# EAGLE schematic rotaryfona (EAGLE 7.7.0)
COMPANY: ADAFRUIT INDUSTRIES; DRAWN: KTOWN; REV: C
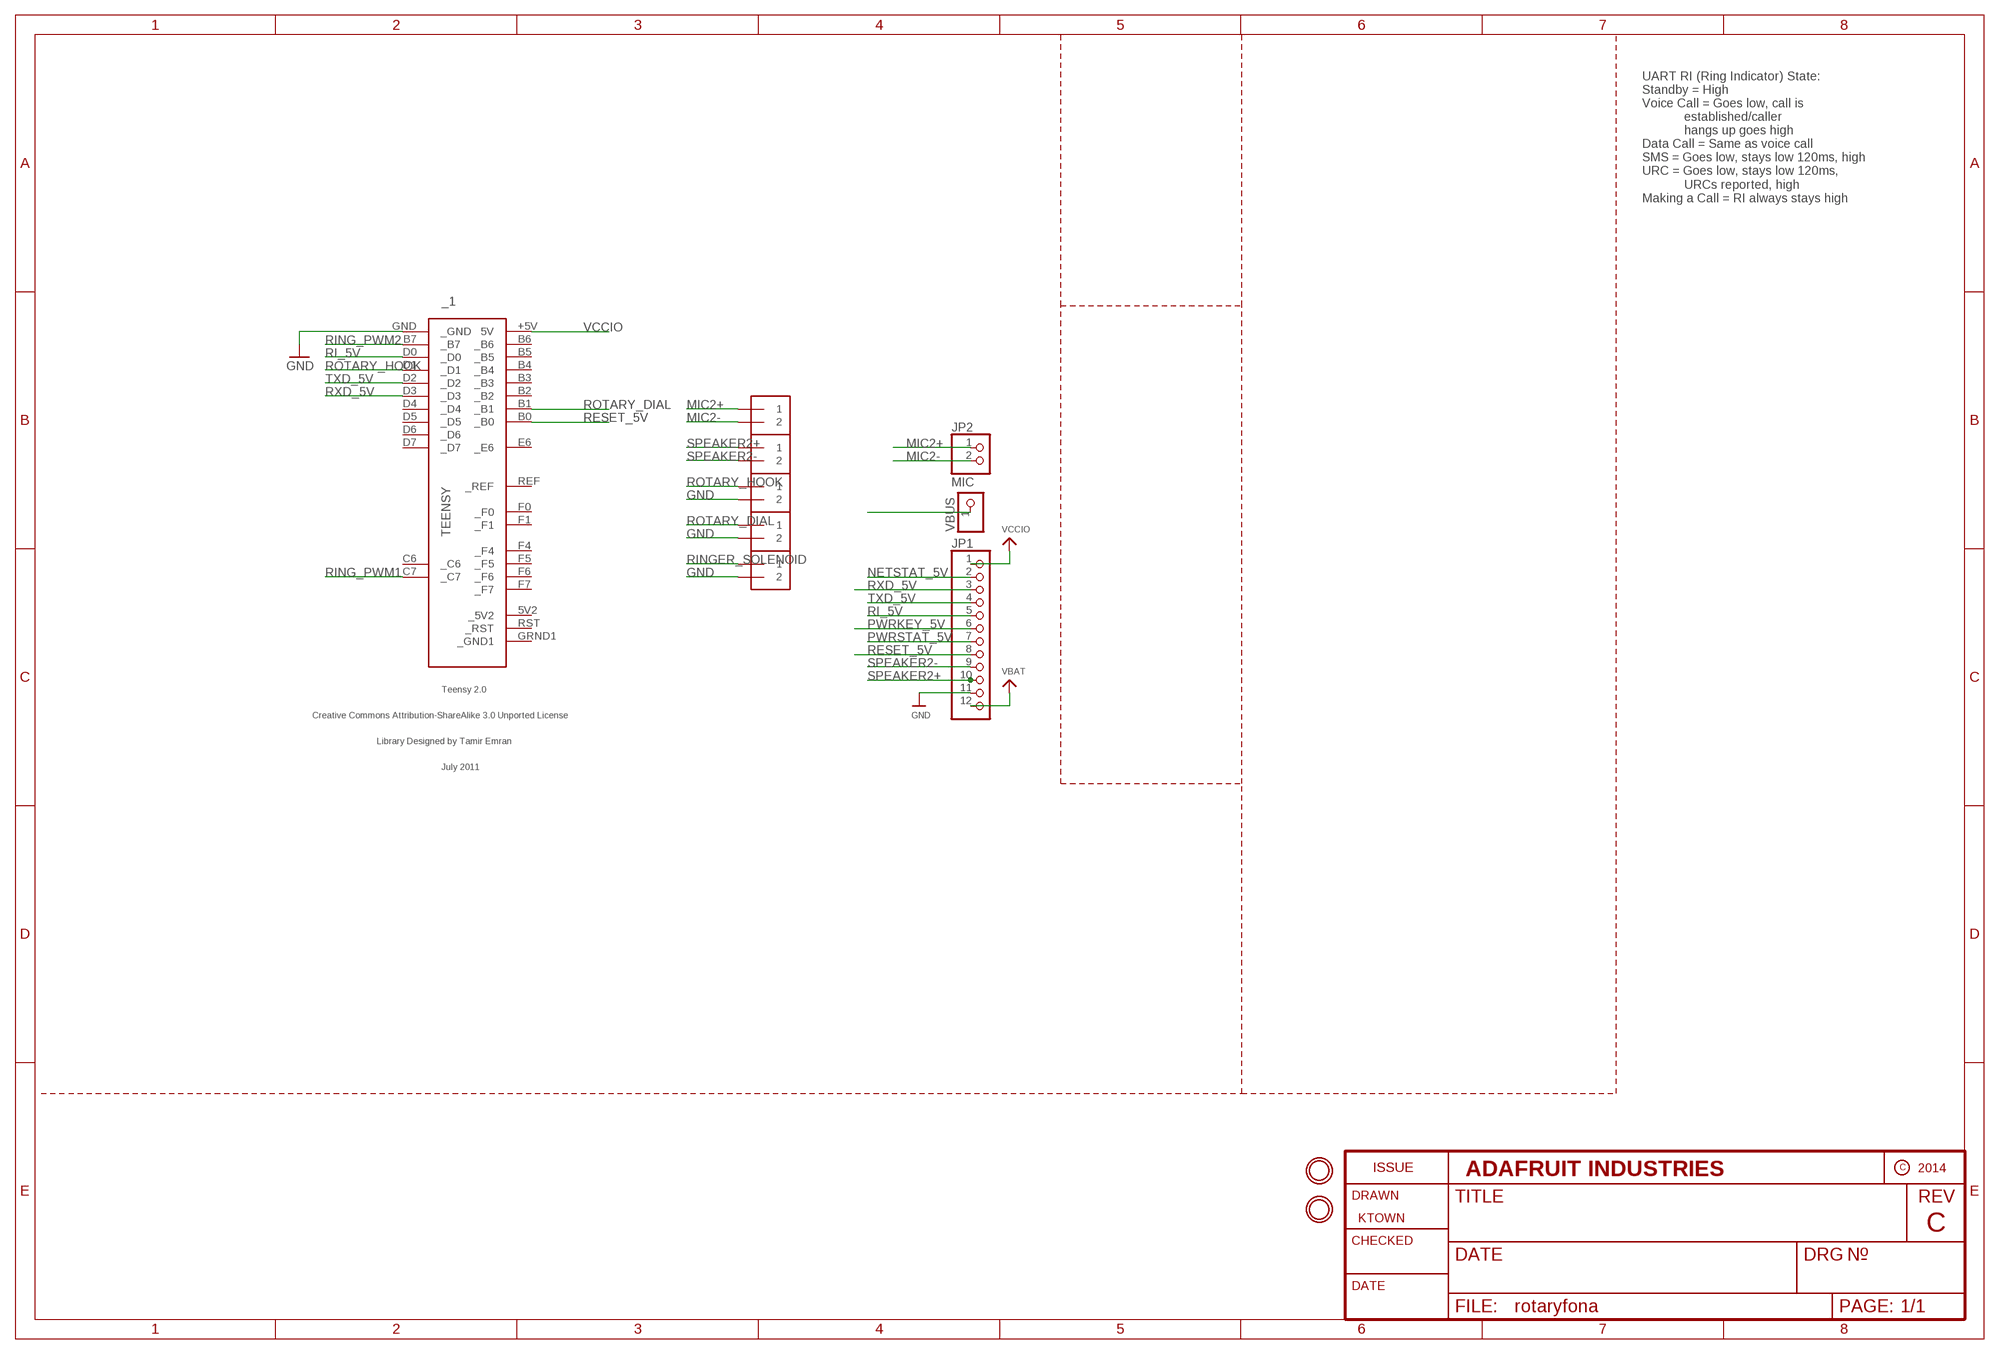
[diagram p0: schematic, sheet 1]

## Parts
_1  TEENSY  [TEENSY]
DIAL  1X2-3.5MM  [1X2-3.5MM]
HOOK  1X2-3.5MM  [1X2-3.5MM]
JP1  PINHD-1X12-CB  [1X12-CB]
JP2  MIC  HEADER-1X2ROUND  [1X02_ROUND]
MIC  1X2-3.5MM  [1X2-3.5MM]
RINGER  1X2-3.5MM  [1X2-3.5MM]
SPK  1X2-3.5MM  [1X2-3.5MM]
U$33  MOUNTINGHOLE2.5  [MOUNTINGHOLE_2.5_PLATED]
U$34  MOUNTINGHOLE2.5  [MOUNTINGHOLE_2.5_PLATED]
VBUS  PINHD-1X1CB  [1X01-CLEANBIG]

## Nets
GND: _1.GND(_GND) DIAL.2 HOOK.2 JP1.11 RINGER.2
MIC2+: JP2.1 MIC.1
MIC2-: JP2.2 MIC.2
N$1: VBUS.1
NETSTAT_5V: JP1.2
PWRKEY_5V: JP1.6
PWRSTAT_5V: JP1.7
RESET_5V: _1.B0(_B0) JP1.8
RI_5V: _1.D0(_D0) JP1.5
RING_PWM1: _1.C7(_C7)
RING_PWM2: _1.B7(_B7)
RINGER_SOLENOID: RINGER.1
ROTARY_DIAL: _1.B1(_B1) DIAL.1
ROTARY_HOOK: _1.D1(_D1) HOOK.1
RXD_5V: _1.D3(_D3) JP1.3
SPEAKER2+: JP1.10 SPK.1
SPEAKER2-: JP1.9 SPK.2
TXD_5V: _1.D2(_D2) JP1.4
VBAT: JP1.12
VCCIO: _1.+5V(5V) JP1.1
Unconnected: _1.5V2(_5V2) _1.B2(_B2) _1.B3(_B3) _1.B4(_B4) _1.B5(_B5) _1.B6(_B6) _1.C6(_C6) _1.D4(_D4) _1.D5(_D5) _1.D6(_D6) _1.D7(_D7) _1.E6(_E6) _1.F0(_F0) _1.F1(_F1) _1.F4(_F4) _1.F5(_F5) _1.F6(_F6) _1.F7(_F7) _1.GRND1(_GND1) _1.REF(_REF) _1.RST(_RST)

## Notes on the sheet
- UART RI (Ring Indicator) State:
  Standby = High
  Voice Call = Goes low, call is 
              established/caller 
              hangs up goes high
  Data Call = Same as voice call
  SMS = Goes low, stays low 120ms, high
  URC = Goes low, stays low 120ms,
              URCs reported, high
  Making a Call = RI always stays high

## Library data of the parts
_1 = teensy:TEENSY: Teensy 2.0 Original Design by Clint Fisher Modified Design by Tamir Emran Licensed Under Creative Commons Attribution-ShareAlike 3.0 Unported (CC BY-SA 3.0)
DIAL HOOK MIC RINGER SPK = adafruit:1X2: 3.5mm Terminal block http://www.ladyada.net/library/pcb/eaglelibrary.html
JP1 = adafruit2:PINHD-1X12: PIN HEADER
JP2 = microbuilder:HEADER-1X2: PIN HEADER
U$33 U$34 = microbuilder:MOUNTINGHOLE: Mounting Hole For #2 screws (0.086"/2.18mm width, 0.094"/2.4mm hole) use 2.5mm; BOM: EXCLUDE
VBUS = adafruit:PINHD-1X1: Pin header 1x1 for 0.1" spacing With round pins